# Altium schematic sheet NEO-M8N.SchDoc
size A3; SheetNumber: 4; SheetTotal: 5
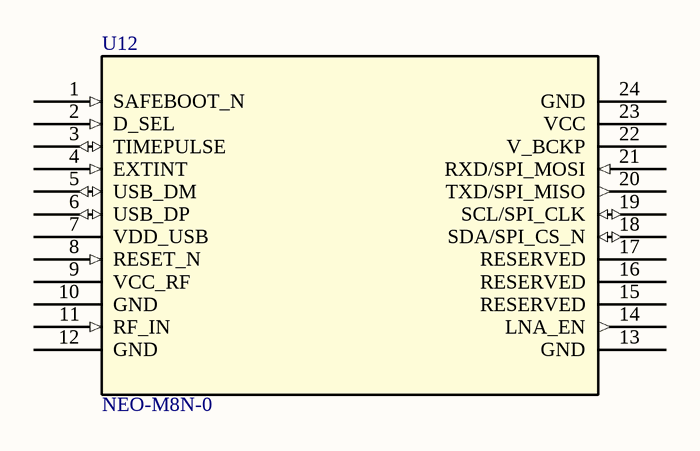
[diagram p0: NEO-M8N.SchDoc]

## Parts
U12  NEO-M8N-0  [MOD24_NEO-M8x_UBL]

## Nets

Not connected (* = marked no-connect by the designer): U12 1(SAFEBOOT_N) 2(D_SEL) 3(TIMEPULSE) 4(EXTINT) 5(USB_DM) 6(USB_DP) 7(VDD_USB) 8(RESET_N) 9(VCC_RF) 10(GND) 11(RF_IN) 12(GND) 13(GND) 14(LNA_EN) 15(RESERVED) 16(RESERVED) 17(RESERVED) 18(SDA/SPI_CS_N) 19(SCL/SPI_CLK) 20(TXD/SPI_MISO) 21(RXD/SPI_MOSI) 22(V_BCKP) 23(VCC) 24(GND)

## Library data of the parts
U12 = NEO-M8N-0: Description; Manufacturer_Name: Ublox; Type: RF; Copyright: Copyright (C) 2025 Ultra Librarian. All rights reserved.; Manufacturer_Part_Number: NEO-M8N-0; RefDes: RefDes